# Altium schematic sheet GammaDetector.SchDoc
size A4; SheetNumber: 2; SheetTotal: 2
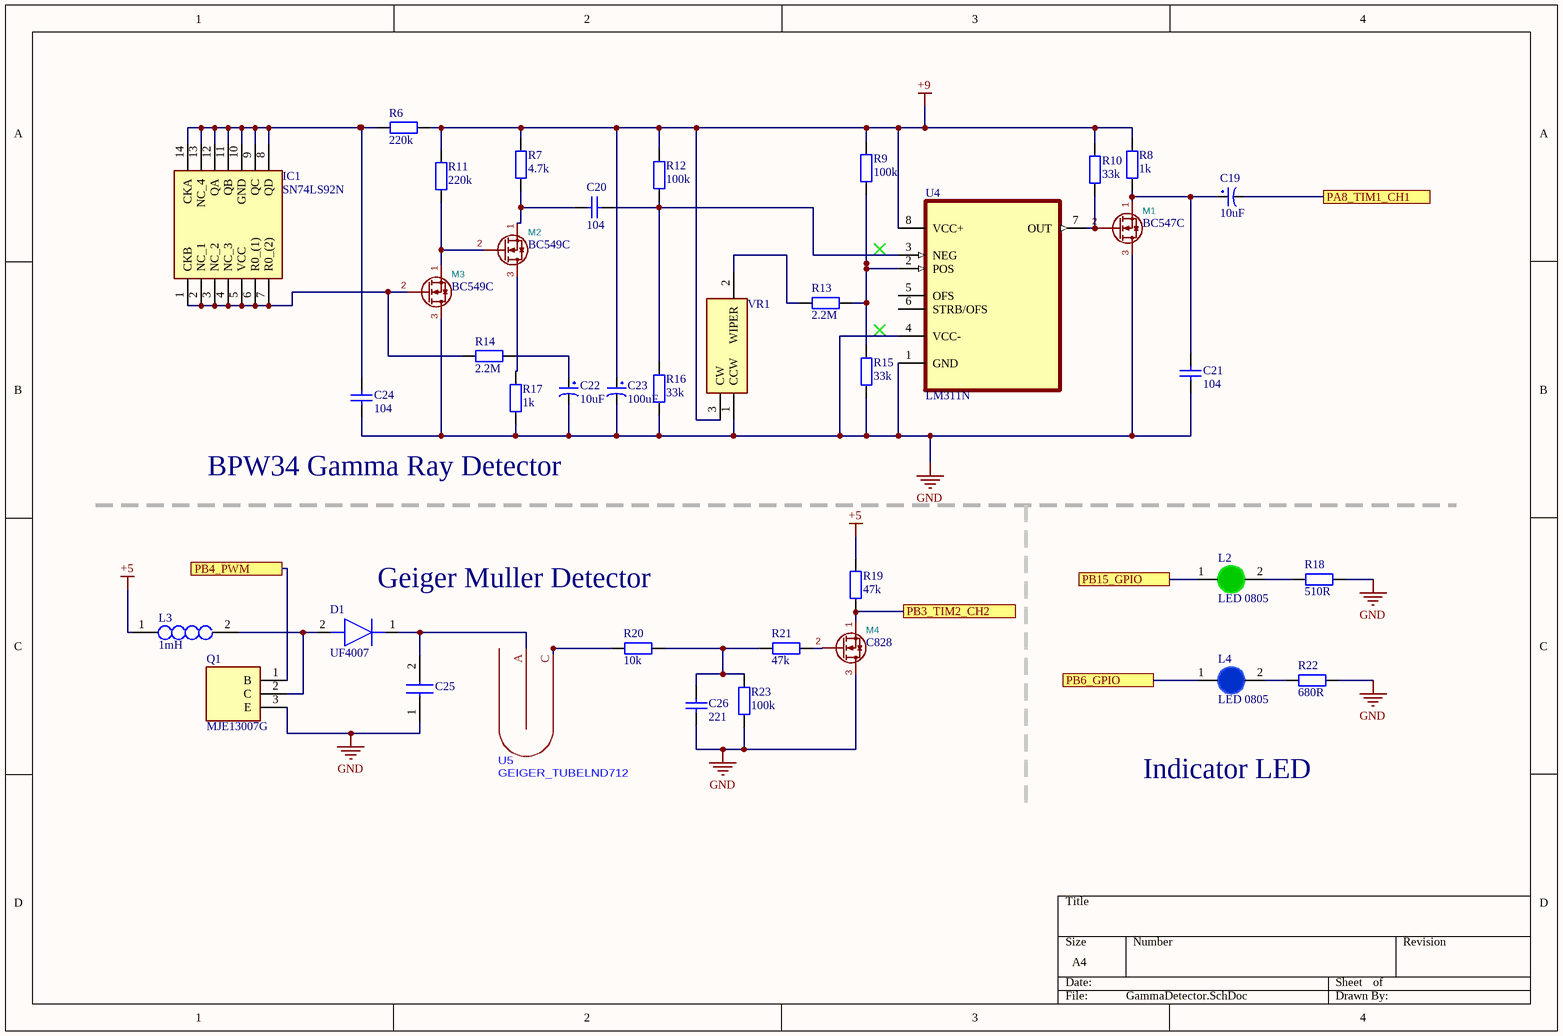
[diagram p0: GammaDetector.SchDoc]

## Parts
C19  10uF  [tu tantalum smd3216]
C20  104  [tu 0805]
C21  104  [tu 0805]
C22  10uF  [tu tantalum smd3216]
C23  100uF  [tu tantalum smd7343]
C24  104  [tu 0805]
C25  (no value)  [ECWF2685JAB]
C26  221  [tu 0805]
D1  UF4007  [DIOAD1413W86L463D238]
IC1  SN74LS92N  [DIP794W53P254L1930H508Q14N]
L2  LED 0805  [LED-0805-Green]
L3  1mH  [RLB1314-101KL]
L4  LED 0805  [LED-0805-Blue]
M1  BC547C  [BC547C]
M2  BC549C  [BC549C]
M3  BC549C  [BC549C]
M4  C828  [BC547C]
Q1  MJE13007G  [TO254P483X1010X2035-3P]
R6  220k  [tro smd 0805]
R7  4.7k  [tro smd 0805]
R8  1k  [tro smd 0805]
R9  100k  [tro smd 0805]
R10  33k  [tro smd 0805]
R11  220k  [tro smd 0805]
R12  100k  [tro smd 0805]
R13  2.2M  [tro smd 0805]
R14  2.2M  [tro smd 0805]
R15  33k  [tro smd 0805]
R16  33k  [tro smd 0805]
R17  1k  [tro smd 0805]
R18  510R  [tro smd 0603]
R19  47k  [tro smd 0805]
R20  10k  [tro smd 0805]
R21  47k  [tro smd 0805]
R22  680R  [Tro SMD 0805]
R23  100k  [tro smd 0805]
U4  LM311N  [LM311N]
U5  GEIGER_TUBELND712  [GEIGER_TUBE]
VR1  (no value)  [3362P_1]

## Ports
PA8_TIM1_CH1, PB3_TIM2_CH2, PB4_PWM, PB6_GPIO, PB15_GPIO

## Nets
+5: L3.1 R19.2
+9: C23.1 R6.2 R7.2 R8.2 R9.2 R10.2 R11.2 R12.2 U4.8(VCC+) VR1.3(CW)
GND: C21.2 C22.2 C23.2 C24.2 C25.1 C26.2 M1.3(D) M3.3(D) M4.3(D) Q1.3(E) R15.1 R16.1 R17.1 R18.2 R22.2 R23.1 U4.1(GND) U4.4(VCC-) VR1.1(CCW)
PA8_TIM1_CH1: C19.2 ; port PA8_TIM1_CH1
PB3_TIM2_CH2: M4.1(S) R19.1 ; port PB3_TIM2_CH2
PB4_PWM: Q1.1(B) ; port PB4_PWM
PB6_GPIO: L4.1(A) ; port PB6_GPIO
PB15_GPIO: L2.1(A) ; port PB15_GPIO
NetC19_1: C19.1 C21.1 M1.1(S) R8.1
NetC20_1: C20.1 M2.1(S) R7.1
NetC20_2: C20.2 R12.1 R16.2 U4.3(NEG)
NetC22_1: C22.1 R14.2
NetC24_1: C24.1 IC1.8(QD) IC1.9(QC) IC1.10(GND) IC1.11(QB) IC1.12(QA) IC1.13(NC_4) IC1.14(CKA) R6.1
NetC25_2: C25.2 D1.1(K) U5.A
NetC26_1: C26.1 R20.2 R21.1 R23.2
NetD1_2: D1.2(A) L3.2 Q1.2(C)
NetIC1_1: IC1.1(CKB) IC1.2(NC_1) IC1.3(NC_2) IC1.4(NC_3) IC1.5(VCC) IC1.6(R0_(1)) IC1.7(R0_(2)) M3.2(G) R14.1
NetL2_2: L2.2(K) R18.1
NetL4_2: L4.2(K) R22.1
NetM1_2: M1.2(G) R10.1 U4.7(OUT)
NetM2_2: M2.2(G) M3.1(S) R11.1
NetM2_3: M2.3(D) R17.2
NetM4_2: M4.2(G) R21.2
NetR9_1: R9.1 R13.2 R15.2 U4.2(POS)
NetR13_1: R13.1 VR1.2(WIPER)
NetR20_1: R20.1 U5.C

Not connected (* = marked no-connect by the designer): U4 5(OFS) 6(STRB/OFS)

## Notes on the sheet
- BPW34 Gamma Ray Detector
- Geiger Muller Detector
- Indicator LED

## Library data of the parts
C19 C22 = Tu tantalum 10uF 16V SMD3216: Dán; Don_Vi: Con; So_Chan: 2; Ten_Linh_Kien: Tụ tantalum 106C-10uF 16V SMD3216; Ma_Hang: MH001954; Chung_Loai: Dán; Kieu_Chan: *
C20 C21 C24 = Tu 0805 104 50V 10%: Dán; Don_Vi: Con; So_Chan: 2; Ten_Linh_Kien: Tụ 0805 104-100nF 10% 50V; Ma_Hang: MH004551; Chung_Loai: Dán; Kieu_Chan: *
C23 = Tu tantalum 100uF 16V SMD7343: Dán; Don_Vi: Con; So_Chan: 2; Ten_Linh_Kien: Tụ tantalum 107C-100uF 16V SMD7343; Ma_Hang: MH002346; Chung_Loai: Dán; Kieu_Chan: *
C25 = ECW-F2685JAB: Capacitor; Manufacturer_Name: Panasonic; Datasheet Link: https://industrial.panasonic.com/cdbs/www-data/pdf/RDI0000/ABD0000C183.pdf; Height: 28.5mm; Manufacturer_Part_Number: ECW-F2685JAB; Mouser Part Number: 667-ECW-F2685JAB; Mouser Price/Stock: https://www.mouser.co.uk/ProductDetail/Panasonic/ECW-F2685JAB?qs=GoZnPdyRfjZ%252BWrNaAmws2A%3D%3D
C26 = Tu 0805 221 50V: Dán; Don_Vi: Con; So_Chan: 2; Ten_Linh_Kien: Tụ 0805 221-220P 50V; Ma_Hang: MH007365; Chung_Loai: Dán; Kieu_Chan: *
D1 = UF4007: Diode; Manufacturer_Name: onsemi; Datasheet Link: https://www.onsemi.com/pub/Collateral/UF4007-D.pdf; Manufacturer_Part_Number: UF4007; Mouser Part Number: 512-UF4007; Mouser Price/Stock: https://www.mouser.co.uk/ProductDetail/onsemi-Fairchild/UF4007?qs=NwIfwa72FlplAHiXupLMBA%3D%3D; Arrow Part Number: UF4007; Arrow Price/Stock: https://www.arrow.com/en/products/uf4007/on-semiconductor?utm_currency=USD&region=europe
IC1 = SN74LS92N: Integrated Circuit; Manufacturer_Name: Texas Instruments; Datasheet Link: http://www.ti.com/lit/gpn/sn74ls92; Height: 5.08mm; Manufacturer_Part_Number: SN74LS92N; Mouser Part Number: 595-SN74LS92N; Mouser Price/Stock: https://www.mouser.co.uk/ProductDetail/Texas-Instruments/SN74LS92N?qs=UG%2F8xqv%2F6WcRLlC4vw0bYA%3D%3D; Arrow Part Number: SN74LS92N; Arrow Price/Stock: https://www.arrow.com/en/products/sn74ls92n/texas-instruments?utm_currency=USD&region=nac
L2 = LED 0805 Xanh La: Dán; Don_Vi: Con; Ma_Hang: MH002326; Ten_Linh_Kien: LED 0805 Màu Xanh Lá (Green); Ghi_Chu: *; Kieu_Chan: *; Chung_Loai: Dán
L3 = RLB1314-101KL: Inductor; Manufacturer_Name: Bourns; Datasheet Link: https://datasheet.datasheetarchive.com/originals/distributors/SFDatasheet-7/sf-000140383.pdf; Manufacturer_Part_Number: RLB1314-101KL; Mouser Part Number: 652-RLB1314-101KL; Mouser Price/Stock: https://www.mouser.co.uk/ProductDetail/Bourns/RLB1314-101KL?qs=AC4ivEYFOTANeGVpHnHmUA%3D%3D; Arrow Part Number: RLB1314-101KL; Arrow Price/Stock: https://www.arrow.com/en/products/rlb1314-101kl/bourns?region=europe
L4 = LED 0805 Xanh Duong: Dán; Don_Vi: Con; Ma_Hang: MH002327; Ten_Linh_Kien: LED 0805 Màu Xanh Dương (Blue); Ghi_Chu: *; Kieu_Chan: *; Chung_Loai: Dán
M1 M4 = BC547C: ki_keywords: MOSFET N-channel; ki_description: N-Channel Power-MOSFET
M2 M3 = BC549C: ki_keywords: MOSFET N-channel; ki_description: N-Channel Power-MOSFET
Q1 = MJE13007G: Transistor; Manufacturer_Name: onsemi; Datasheet Link: https://www.onsemi.com/pub/Collateral/MJE13007-D.PDF; Height: 4.83mm; Manufacturer_Part_Number: MJE13007G; Mouser Part Number: 863-MJE13007G; Mouser Price/Stock: https://www.mouser.co.uk/ProductDetail/onsemi/MJE13007G?qs=HVbQlW5zcXUR%252BbxH%252BcvjKA%3D%3D; Arrow Part Number: MJE13007G; Arrow Price/Stock: https://www.arrow.com/en/products/mje13007g/on-semiconductor?region=europe
R6 R11 R13 R14 = Tro 0805 5% 220k: Dán; Don_Vi: Con; So_Chan: 2; Ten_Linh_Kien: Trở 0805 5% 220k; Ma_Hang: MH005258; Chung_Loai: Dán; Kieu_Chan: *
R7 = Tro 0805 5% 4.7k: Dán; Don_Vi: Con; So_Chan: 2; Ten_Linh_Kien: Trở 0805 5% 4.7k; Ma_Hang: MH005307; Chung_Loai: Dán; Kieu_Chan: *
R8 R17 = Tro 0805 1% 1k: Dán; Don_Vi: Con; So_Chan: 2; Ten_Linh_Kien: Trở 0805 1% 1k; Ma_Hang: MH005468; Chung_Loai: Dán; Kieu_Chan: *
R9 R12 R23 = Tro 0805 5% 100k: Dán; Don_Vi: Con; So_Chan: 2; Ten_Linh_Kien: Trở 0805 5% 100k; Ma_Hang: MH005250; Chung_Loai: Dán; Kieu_Chan: *
R10 R15 R16 = Tro 0805 5% 33k: Dán; Don_Vi: Con; So_Chan: 2; Ten_Linh_Kien: Trở 0805 5% 33k; Ma_Hang: MH005316; Chung_Loai: Dán; Kieu_Chan: *
R18 = Tro 0603 5% 510R: Dán; Don_Vi: Con; So_Chan: 2; Ten_Linh_Kien: Trở 0603 5% 510R; Ma_Hang: MH007667; Chung_Loai: Dán; Kieu_Chan: *
R19 R21 = Tro 0805 5% 47k: Dán; Don_Vi: Con; So_Chan: 2; Ten_Linh_Kien: Trở 0805 5% 47k; Ma_Hang: MH005320; Chung_Loai: Dán; Kieu_Chan: *
R20 = Tro 0805 5% 10k: Dán; Don_Vi: Con; So_Chan: 2; Ten_Linh_Kien: Trở 0805 5% 10k; Ma_Hang: MH005239; Chung_Loai: Dán; Kieu_Chan: *
R22 = Tro 0805 5% 680R: Dán; Don_Vi: Con; Ma_Hang: MH005344; So_Chan: 2; Ten_Linh_Kien: Trở 0805 5% 680R; Chung_Loai: Dán; Kieu_Chan: *
U4 = LM311N: Comparator General Purpose DTL, MOS, Open-Collector, Open-Emitter, RTL, TTL 8-PDIP; MF: ON Semiconductor; MP: LM311N; SnapEDA_Link: https://www.snapeda.com/parts/LM311N/ON%20Semiconductor/view-part/11709/?ref=snap; Availability: Bad; Package: PDIP-8 ON Semiconductor; Check_prices: https://www.snapeda.com/parts/LM311N/ON%20Semiconductor/view-part/11709/?ref=eda; Value: *; Price: None
VR1 = 3362P-1-253LF: Variable Resistor; Manufacturer_Name: Bourns; Datasheet Link: https://www.bourns.com/docs/Product-Datasheets/3362.pdf; Manufacturer_Part_Number: 3362P-1-253LF; Mouser Part Number: 652-3362P-1-253LF; Mouser Price/Stock: https://www.mouser.co.uk/ProductDetail/Bourns/3362P-1-253LF?qs=zzU3Rk5EtVOwWhuxjgYxLA%3D%3D; Arrow Part Number: 3362P-1-253LF; Arrow Price/Stock: https://www.arrow.com/en/products/3362p-1-253lf/bourns?region=nac